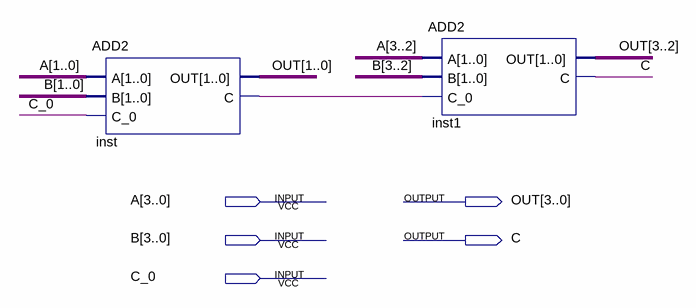
[diagram p0: schematic sheet]
// Quartus schematic ADD4.bdf as structural Verilog: 2 symbols, 5 pins
module ADD4 (
  input  [3:0] A,
  input  [3:0] B,
  input  C_0,
  output [3:0] OUT,
  output C
);

  wire inst_c;

  ADD2 inst (.A(A[1:0]), .B(B[1:0]), .C_0(C_0), .OUT(OUT[1:0]), .C(inst_c));
  ADD2 inst1 (.A(A[3:2]), .B(B[3:2]), .C_0(inst_c), .OUT(OUT[3:2]), .C(C));
endmodule
